# EAGLE design L_SaturationMeter (EAGLE 6.1)
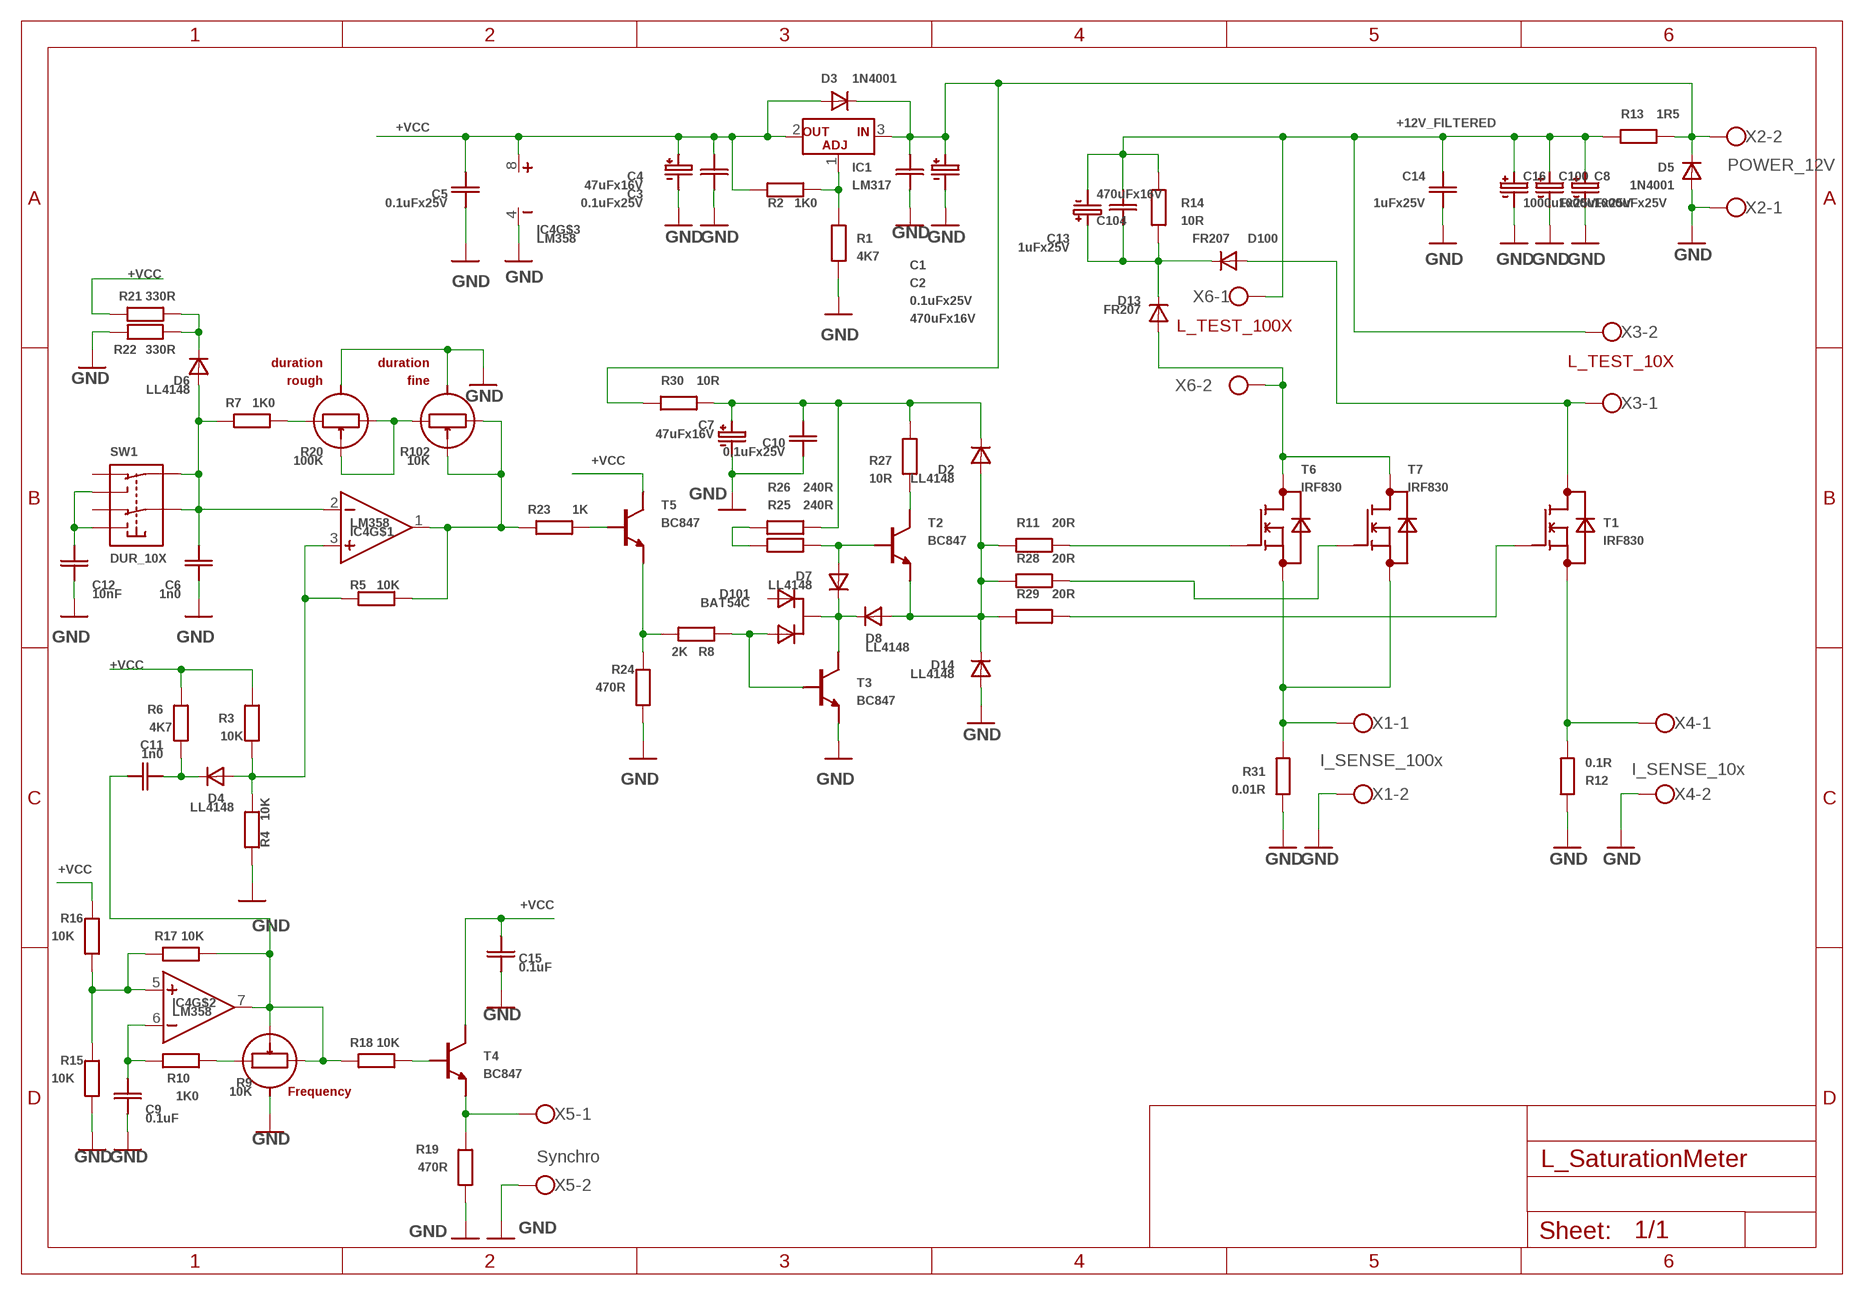
[diagram p0: schematic, sheet 1]

## Parts
C1  0.1uFx25V  CSMD_1206_BIG_GAP  [RSMD_1206_BIG_GAP]
C2  470uFx16V  CE8.2MM  [CE_8.2MM]
C3  0.1uFx25V  CSMD_0805  [RSMD_0805]
C4  47uFx16V  CE5.2MM  [CE_5.2MM]
C5  0.1uFx25V  CSMD_0805  [RSMD_0805]
C6  1n0  CSMD_0805  [RSMD_0805]
C7  47uFx16V  CE5.2MM  [CE_5.2MM]
C8  1000uFx25V  CE10MM  [CE_10MM]
C9  0.1uF  CSMD_0805  [RSMD_0805]
C10  0.1uFx25V  CSMD_0805  [RSMD_0805]
C11  1n0  CSMD_0805  [RSMD_0805]
C12  10nF  CSMD_0805  [RSMD_0805]
C13  1uFx25V  CSMD_1206_BIG_GAP  [RSMD_1206_BIG_GAP]
C14  1uFx25V  CSMD_1206_BIG_GAP  [RSMD_1206_BIG_GAP]
C15  0.1uF  CSMD_0805  [RSMD_0805]
C16  1000uFx25V  CE10MM  [CE_10MM]
C100  1000uFx25V  CE10MM  [CE_10MM]
C104  470uFx16V  CE8.2MM  [CE_8.2MM]
D2  LL4148  LL4147SOD-80  [SOD-80]
D3  1N4001  1N4001DO-41_15MM  [DO-41_15MM]
D4  LL4148  LL4147SOD-80  [SOD-80]
D5  1N4001  1N4001DO-41_15MM  [DO-41_15MM]
D6  LL4148  LL4147SOD-80  [SOD-80]
D7  LL4148  LL4147SOD-80  [SOD-80]
D8  LL4148  LL4147SOD-80  [SOD-80]
D13  FR207  1N4001DO-41_5MM  [DO-41_5MM]
D14  LL4148  LL4147SOD-80  [SOD-80]
D100  FR207  1N4001DO-41_20MM  [DO-41_20MM]
D101  BAT54C  BAT54C(SOT23)  [SOT23_SMALL_PADS]
IC1  LM317  LM317(D2PAK)  [D2PAK]
IC4  LM358  LM358DIP8  [DIP8]
R1  4K7  RSMD_0805  [RSMD_0805]
R2  1K0  RSMD_0805  [RSMD_0805]
R3  10K  RSMD_0805  [RSMD_0805]
R4  10K  RSMD_0805  [RSMD_0805]
R5  10K  RSMD_0805  [RSMD_0805]
R6  4K7  RSMD_0805  [RSMD_0805]
R7  1K0  RSMD_0805  [RSMD_0805]
R8  2K  RSMD_0805  [RSMD_0805]
R9  10K  R_ADJ_WITH_SHIELDSP4-AM  [SP3-4AM]
R10  1K0  RSMD_0805  [RSMD_0805]
R11  20R  RSMD_0805  [RSMD_0805]
R12  0.1R  R1.0W_VERT  [R_1.0W_VERTICAL]
R13  1R5  R2.0W  [R_2.0W]
R14  10R  R1.0W_VERT  [R_1.0W_VERTICAL]
R15  10K  RSMD_0805  [RSMD_0805]
R16  10K  RSMD_0805  [RSMD_0805]
R17  10K  RSMD_0805  [RSMD_0805]
R18  10K  RSMD_0805  [RSMD_0805]
R19  470R  RSMD_1206_BIG_GAP  [RSMD_1206_BIG_GAP]
R20  100K  R_ADJ_WITH_SHIELDSP4-AM  [SP3-4AM]
R21  330R  RSMD_0805  [RSMD_0805]
R22  330R  RSMD_0805  [RSMD_0805]
R23  1K  RSMD_1206_BIG_GAP  [RSMD_1206_BIG_GAP]
R24  470R  RSMD_1206_BIG_GAP  [RSMD_1206_BIG_GAP]
R25  240R  RSMD_1206_BIG_GAP  [RSMD_1206_BIG_GAP]
R26  240R  RSMD_1206_BIG_GAP  [RSMD_1206_BIG_GAP]
R27  10R  RSMD_1206_BIG_GAP  [RSMD_1206_BIG_GAP]
R28  20R  RSMD_0805  [RSMD_0805]
R29  20R  RSMD_0805  [RSMD_0805]
R30  10R  R0.5W  [R_0.5W]
R31  0.01R  RSMD_2512  [RSMD_2512]
R102  10K  R_ADJ_WITH_SHIELDSP4-AM  [SP3-4AM]
SW1  DUR_10X  SWITCH_DOUBLE(2.54X4MM)  [SWITCH_DOUBLE_2.54X4.0MM]
T1  IRF830  IRF830D2PAK  [D2PAK]
T2  BC847  BC847SOT23_SMALL_PADS  [SOT23_SMALL_PADS]
T3  BC847  BC847SOT23_SMALL_PADS  [SOT23_SMALL_PADS]
T4  BC847  BC847SOT23_SMALL_PADS  [SOT23_SMALL_PADS]
T5  BC847  BC847SOT23_SMALL_PADS  [SOT23_SMALL_PADS]
T6  IRF830  IRF830D2PAK  [D2PAK]
T7  IRF830  IRF830D2PAK  [D2PAK]
X1  I_SENSE_100x  W237-102  [W237-102]
X2  POWER_12V  W237-102  [W237-102]
X3  L_TEST_END  W237-102  [W237-102]
X4  I_SENSE_10x  W237-102  [W237-102]
X5  Synchro  W237-102  [W237-102]
X6  L_TEST_END  W237-102  [W237-102]

## Nets
+12V_FILTERED: C8.PLUS C13.PAD_0(PIN0) C14.PAD_0(PIN0) C16.PLUS C100.PLUS C104.MINUS R13.PAD1(PIN1) R14.PAD1(PIN1) X3.2 X6.1
+VCC: C3.PAD_0(PIN0) C4.PLUS C5.PAD_0(PIN0) C15.PAD_0(PIN0) D3.ANODE IC1.2(OUT) IC4.8(VCC) R2.PAD_1(PIN1) R3.PAD_1(PIN1) R6.PAD_0(PIN0) R16.PAD_1(PIN1) R21.PAD_1(PIN1) T4.3(C) T5.3(C)
GND: C1.PAD_1(PIN1) C2.MINUS C3.PAD_1(PIN1) C4.MINUS C5.PAD_1(PIN1) C6.PAD_1(PIN1) C7.MINUS C8.MINUS C9.PAD_1(PIN1) C10.PAD_1(PIN1) C12.PAD_1(PIN1) C14.PAD_1(PIN1) C15.PAD_1(PIN1) C16.MINUS C100.MINUS D5.ANODE D14.ANODE IC4.4(GND) R1.PAD_0(PIN0) R4.PAD_1(PIN1) R9.PACKAGE1(PACKAGE) R9.PACKAGE2(PACKAGE) R12.PAD1(PIN1) R15.PAD_0(PIN0) R19.PAD_1(PIN1) R20.PACKAGE1(PACKAGE) R20.PACKAGE2(PACKAGE) R22.PAD_0(PIN0) R24.PAD_1(PIN1) R31.PAD0(PIN0) R102.PACKAGE1(PACKAGE) R102.PACKAGE2(PACKAGE) T3.2(E) X1.2 X2.1 X4.2 X5.2
N$1: D7.ANODE R25.PAD_1(PIN1) T2.1(B)
N$2: R11.PAD_1(PIN1) T6.1(GATE)
N$3: R12.PAD_0(PIN0) T1.3(SOURCE) X4.1
N$4: C9.PAD_0(PIN0) IC4.6(IN-) R10.PAD_0(PIN0)
N$5: R9.END_A R10.PAD_1(PIN1)
N$6: C13.PAD_1(PIN1) C104.PLUS D13.CATHODE D100.CATHODE R14.PAD_0(PIN0)
N$7: C6.PAD_0(PIN0) D6.ANODE IC4.2(IN-) R7.PAD_1(PIN1) SW1.CENTER1 SW1.CENTER2
N$8: IC1.1(ADJ) R1.PAD_1(PIN1) R2.PAD_0(PIN0)
N$10: D100.ANODE T1.2(DRAIN) X3.1
N$11: C1.PAD_0(PIN0) C2.PLUS D3.CATHODE D5.CATHODE IC1.3(IN) R13.PAD_0(PIN0) R30.PAD1(PIN1) X2.2
N$12: IC4.5(IN+) R15.PAD_1(PIN1) R16.PAD_0(PIN0) R17.PAD_1(PIN1)
N$13: C11.PAD_1(PIN1) IC4.7(OUT) R9.END_B R9.MIDDLE R17.PAD_0(PIN0) R18.PAD_1(PIN1)
N$14: D4.ANODE IC4.3(IN+) R3.PAD_0(PIN0) R4.PAD_0(PIN0) R5.PAD_1(PIN1)
N$15: R20.END_B R20.MIDDLE R102.END_A
N$16: R25.PAD_0(PIN0) R26.PAD_1(PIN1)
N$18: C11.PAD_0(PIN0) D4.CATHODE R6.PAD_1(PIN1)
N$19: R18.PAD_0(PIN0) T4.1(B)
N$20: R19.PAD_0(PIN0) T4.2(E) X5.1
N$21: D6.CATHODE R21.PAD_0(PIN0) R22.PAD_1(PIN1)
N$22: C12.PAD_0(PIN0) SW1.POS_A1 SW1.POS_A2
N$23: IC4.1(OUT) R5.PAD_0(PIN0) R23.PAD_1(PIN1) R102.END_B R102.MIDDLE
N$24: R23.PAD_0(PIN0) T5.1(B)
N$25: R8.PAD_0(PIN0) R24.PAD_0(PIN0) T5.2(E)
N$26: D101.2(ANODE2) R8.PAD_1(PIN1) T3.1(B)
N$27: D7.CATHODE D8.CATHODE D101.3(CATHODE) T3.3(C)
N$28: R28.PAD_1(PIN1) T7.1(GATE)
N$29: R27.PAD_1(PIN1) T2.3(C)
N$30: D2.ANODE D8.ANODE D14.CATHODE R11.PAD_0(PIN0) R28.PAD_0(PIN0) R29.PAD_0(PIN0) T2.2(E)
N$31: R29.PAD_1(PIN1) T1.1(GATE)
N$32: R31.PAD1(PIN1) T6.3(SOURCE) T7.3(SOURCE) X1.1
N$33: C7.PLUS C10.PAD_0(PIN0) D2.CATHODE R26.PAD_0(PIN0) R27.PAD_0(PIN0) R30.PAD_0(PIN0)
N$34: D13.ANODE T6.2(DRAIN) T7.2(DRAIN) X6.2
N$35: R7.PAD_0(PIN0) R20.END_A
Unconnected: D101.1(ANODE1) SW1.POS_B1 SW1.POS_B2

## Notes on the sheet
- L_TEST_100X
- duration | duration | L_TEST_10X
- rough | fine
- Frequency

## Library data of the parts
C1 C3 C5 C6 C9-C15 = __MyCommonLib1:C
C2 C4 C7 C8 C16 C100 C104 = __MyCommonLib1:CE
D2 D4 D6-D8 D14 = __MyCommonLib1:LL4147
D3 D5 D13 D100 = __MyCommonLib1:1N4001
D101 = __MyCommonLib1:BAT54C
IC1 = __MyCommonLib1:LM317
IC4 = __MyCommonLib1:LM358
R1-R8 R10-R19 R21-R31 = __MyCommonLib1:R
R9 R20 R102 = __MyCommonLib1:R_ADJ_WITH_SHIELD
SW1 = __MyCommonLib1:SWITCH_DOUBLE
T1 T6 T7 = __MyCommonLib1:IRF830
T2-T5 = __MyCommonLib1:BC847
X1-X6 = con-wago-500:W237-102: WAGO SCREW CLAMP; MPN: 237-102; OC_FARNELL: unknown; OC_NEWARK: 70K9898

## Board
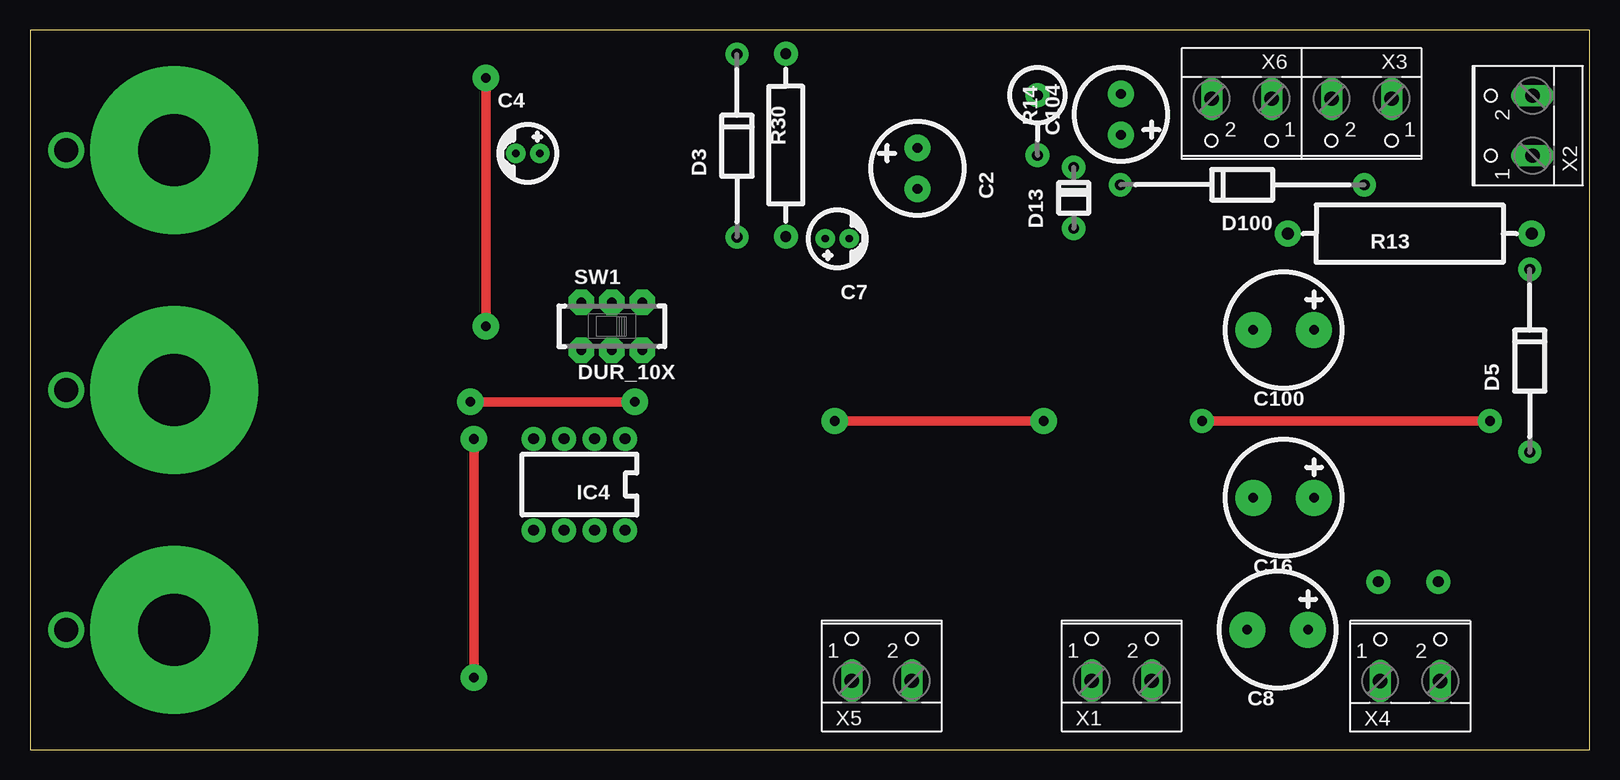
[diagram p1: board, top side]
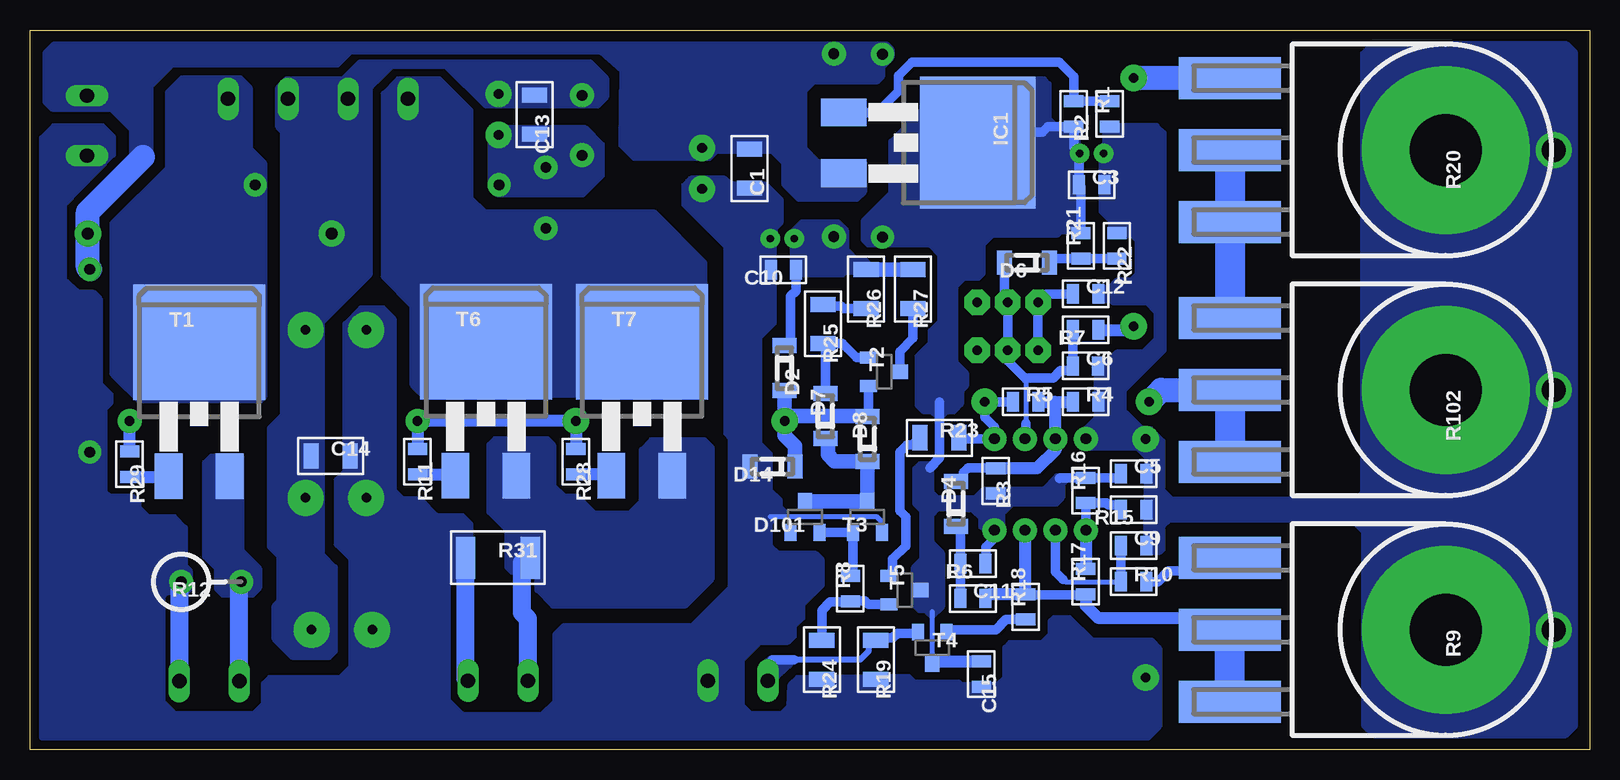
[diagram p2: board, bottom side, seen from below]

Size 130 x 60 mm. Coordinates in mm from the lower left corner, seen from the top.
Outline: 0,0 130,0 130,60 0,60 0,0
Copper layers (1*16): Top 0.035mm / dielectric 1.5mm / Bottom 0.035mm
Design rules: minimum track width 0.4mm, minimum drill 0.6mm, track to track 0.35mm, track to pad 0.35mm, pad to pad 0.35mm, via to via 0.35mm, smd to smd 0.35mm, copper to edge 0.5mm, drill to drill 8mil, minimum pad ring 10mil, minimum via ring 8mil, stop-mask expansion 4mil, vias tented up to drill 0mil, thermal gap 10mil

### Footprints (pad centres in the part's own frame; a part is rotated, then mirrored left to right if it is on the bottom)
RSMD_1206_BIG_GAP = smd 1.25 x 2.1: PAD_0 -1.625,0; PAD_1 1.625,0
CE_8.2MM = drill 0.8 pad 2.2: MINUS -1.7,0; PLUS 1.7,0
RSMD_0805 = smd 1 x 1.6: PAD_0 -1.05,0; PAD_1 1.05,0
CE_5.2MM = drill 0.6 pad 1.6: MINUS -1,0; PLUS 1,0
CE_10MM = drill 0.8 pad 3: MINUS -2.54,0; PLUS 2.54,0
SOD-80 = smd 1.25 x 2: ANODE 1.875,0; CATHODE -1.875,0
DO-41_15MM = drill 0.9 pad 1.93: ANODE -7.62,0; CATHODE 7.62,0
DO-41_5MM = drill 0.9 pad 1.93: ANODE -2.54,0; CATHODE 2.54,0
DO-41_20MM = drill 0.9 pad 1.93: ANODE -10.16,0; CATHODE 10.16,0
SOT23_SMALL_PADS = smd 1 x 1.4: 1 1.2,1.3; 2 -1.2,1.3 | smd 1.2 x 1.4: 3 0,-1.3
D2PAK = smd 2.32 x 3.81: 1 -2.54,-11.17; 3 2.54,-11.17 | smd 11 x 9.65: 2 0,0
DIP8 = drill 0.9 pad 2: 1 -3.81,-3.81; 2 -1.27,-3.81; 3 1.27,-3.81; 4 3.81,-3.81; 5 3.81,3.81; 6 1.27,3.81; 7 -1.27,3.81; 8 -3.81,3.81
SP3-4AM = smd 3.5 x 8.5: END_A -6,-18; END_B 6,-18; MIDDLE 0,-18 | drill 6 pad 14: PACKAGE1 0,0 | drill 2 pad 3: PACKAGE2 0,9
R_1.0W_VERTICAL = drill 0.9 pad 2: PAD1 2.5,0; PAD_0 -2.5,0
R_2.0W = drill 1 pad 2.2: PAD1 10.16,0; PAD_0 -10.16,0
R_0.5W = drill 0.9 pad 2: PAD1 7.62,0; PAD_0 -7.62,0
RSMD_2512 = smd 1.6 x 3.5: PAD0 -2.7,0; PAD1 2.7,0
SWITCH_DOUBLE_2.54X4.0MM = drill 0.8 pad 2.1 octagon: CENTER1 0,-2; CENTER2 0,2; POS_A1 -2.54,-2; POS_A2 -2.54,2; POS_B1 2.54,-2; POS_B2 2.54,2
W237-102 = drill 1.194 long: 1 -2.5,-1.27; 2 2.5,-1.27

### Placement (x,y rotation side)
C1  70.03,48.45 270 bottom
C2  73.98,48.45 90 top
C3  41.5,47.1 0 bottom
C4  41.5,49.7 0 top
C5  38,23 0 bottom
C6  42.01,31.99 0 bottom
C7  67.3,42.6 180 top
C8  104,10 0 top
C9  38,17 0 bottom
C10  67.2,40 180 bottom
C11  51.4,12.6 0 bottom
C12  42,38 0 bottom
C13  87.95,52.95 270 bottom
C14  104.94,24.47 0 bottom
C15  50.7,6.3 270 bottom
C16  104.5,21 0 top
C100  104.5,34.99 0 top
C104  90.94,52.95 270 top
D2  67.11,31.8 270 bottom
D3  58.93,50.35 90 top
D4  52.8,20.5 90 bottom
D5  125.02,32.42 90 top
D6  46.9,40.6 180 bottom
D7  63.7,27.8 90 bottom
D8  60.2,25.9 90 bottom
D13  87,46 90 top
D14  68.1,23.6 180 bottom
D100  101.06,47.09 180 top
D101  65.4,19.4 180 bottom
IC1  51,50.59 270 bottom
IC4  45.8,22.1 180 top
R1  40,53 90 bottom
R2  43,53 270 bottom
R3  49.5,22.4 270 bottom
R4  42,29 0 bottom
R5  47,29 0 bottom
R6  51.4,15.5 180 bottom
R7  42,35 180 bottom
R8  61.61,13.41 90 bottom
R9  12,10 270 bottom
R10  38,14 0 bottom
R11  97.7,24 270 bottom
R12  114.9,14 180 bottom
R13  115.01,43.02 180 top
R14  83.99,52.05 90 top
R15  38,20 180 bottom
R16  42,21.6 90 bottom
R17  42,14 90 bottom
R18  47,11.9 90 bottom
R19  59.5,7.5 270 bottom
R20  12,50 270 bottom
R21  42.4,42 90 bottom
R22  39.4,42 270 bottom
R23  54.2,26 0 bottom
R24  64,7.5 270 bottom
R25  63.9,35.5 270 bottom
R26  60.3,38.4 270 bottom
R27  56.4,38.4 270 bottom
R28  84.5,24 270 bottom
R29  121.7,23.8 270 bottom
R30  63,50.4 90 top
R31  91,16 0 bottom
R102  12,30 270 bottom
SW1  48.5,35.3 0 top
T1  115.89,33.96 0 bottom
T2  58.8,31.5 90 bottom
T3  60.2,19.4 180 bottom
T4  54.8,8.5 0 bottom
T5  57.1,13.3 90 bottom
T6  92,34 0 bottom
T7  79,34 0 bottom
X1  91,7 0 top
X2  123.98,52.02 90 top
X3  111,53 180 top
X4  115.05,6.98 0 top
X5  71,7 0 top
X6  101,53 180 top

### Tracks (layer width: path | path; a pad name or v marks a point on that pad's centre or on a via)
+12V_FILTERED
  pour Bottom (no thermals): 108.6,55.9 102.5,55.9 101.7,55.1 101.7,39.6 105.7,35.6 105.7,16.3 104.6,15.2 104.6,8.2 105.1,7.7 108.1,7.7 109.6,9.2 109.6,12 109.2,12.4 109.2,16.1 110,16.9 110,26.8 108.9,27.9 108.9,51.5 109.3,51.9 109.3,55.2
  pour Bottom (no thermals): 82.7,53.7 92,53.7 95.3,57 99.9,57 101.9,55 101.9,53 104.8,53 104.8,55 102.5,57.3 83.3,57.3 82,56 82,54.4
+VCC
  Bottom 0.4: 54.8,11.5 T4.3
  Bottom 0.8: IC4.8 49.61,17.59 50.3,16.9 50.3,15.55 R6.PAD_0 | R21.PAD_1 42.4,46.95 C3.PAD_0 42.55,49.65 C4.PLUS 43,50.2 R2.PAD_1 45.15,51.95 45.6,51.5 50.09,51.5 IC1.2 | 55,23.5 54.2,24.3 54.2,29 | C5.PAD_0 39.05,22.65 R16.PAD_1 44.15,22.65 44.2,22.6
  Bottom 1: T4.3 54.65,7.35 C15.PAD_0
  pour Bottom (no thermals): 55.5,55.9 45.5,55.9 45.1,55.5 45.1,52.6 44.5,52 42.9,52 42.7,51.8 42.7,50 42.4,49.7 42.4,43.2 44.1,43.2 44.4,42.9 49.8,42.9 50.6,42.1 50.6,39.7 51,39.3 52.2,39.3 52.9,38.6 52.9,32.3 52,31.4 52,30.3 52.4,29.9 52.4,28.8 53,28.2 53.6,28.2 54,27.8 54.4,27.8 54.8,28.2 55.5,28.2 56,28.7 56,32.8 54.9,33.9 54.9,34.9 54.1,35.7 54.1,41.2 55,42.1 60.1,42.1 60.5,42.5 60.5,44.1 58.2,46.4 58.2,50.7 55.6,53.4
  pour Bottom (no thermals): 44,22.1 44,21 44.5,20.5 48.2,20.5 49,19.7 49,18.2 50.3,18.2 50.7,18.6 50.7,19.3 51.4,20 54.3,20.1 54.9,19.5 54.9,17.3 54,16.4 54,11.9 54.8,11.1 55.3,11.6 55.8,11.6 56.3,12.1 56.3,15.2 55.6,15.9 55.6,19.9 56.2,20.5 56.2,23.4 55.8,23.8 54.9,23.8 54.9,21.5 54.4,21 51.2,21 50.5,21.7 45.5,21.7 44.4,22.8 43.9,22.8 43.6,22.5
GND  (via drill 0.8 pad 2.2)
  Top 0.8: v37,25.9 v37,6
  Bottom 0.4: T3.2 59,19 59.4,19.4 68.3,19.4
  Bottom 0.8: C5.PAD_1 37,23
  Bottom 1.5: X1.2 93.7,5.93 R31.PAD0 | R12.PAD1 117.55,13.85 X4.2
  pour Bottom (no thermals): 100.6,36.8 99.7,35.9 99.7,21.6 99,20.9 97.5,20.9 96.1,19.5 94,19.5 93.3,18.8 93.3,14.2 93.2,14.1 94.9,14.1 95.2,13.8 95.2,4.1 94,2.9 87.3,2.9 86.2,4 86.2,9.6 85.5,10.3 70.7,10.3 70.7,3.7 70,3 67.3,3 66.7,3.6 66.6,5.4 66,6 56.8,6.1 56.3,5.6 52.6,5.6 52.4,5.4 49.3,5.4 48.7,6 48.7,8.5 48.3,8.9 45.6,8.9 44.9,9.6 44.9,10.7 44.6,11 43.4,11 41.5,9.1 36.5,9.1 35.9,8.5 35.9,1.9 36.8,1 129,1 129,51 128,52 124,52 123.1,51.1 123.1,49.6 127.2,45.4 127.2,39.2 126,38.1 124.7,38.1 124.2,37.6 124.2,30.5 123.3,29.6 123.3,28.9 123.8,28.4 123.8,21.5 123.4,21.1 121.5,21.1 121,20.6 121,20.2 120.2,19.4 118,19.4 117.1,18.5 117.1,15.3 116.7,14.9 116.7,13.4 117,13.1 118.6,13.1 119,12.7 119,4 118,3 111.3,3 110.5,3.8 110.5,5.5 110,6 104.1,6 103.2,6.9 103.2,15.9 104.4,17.1 104.4,22.5 103.7,23.2 103.7,35.5 102.4,36.8
  pour Bottom (no thermals): 67.4,45.8 68.7,47.1 71.6,47.1 72.1,47.6 74.9,47.6 75.5,47 75.5,45.5 72,42 72,26.4 71.6,26 71.6,13.5 75,10.1 75,5 70.7,5 70.7,7.5 69.2,9 66.8,9 66.3,9.5 66.3,10.3 65.6,11 65.6,12.1 64,13.7 64,15.8 64.5,16.3 67.6,16.3 68.3,17 68.3,18.9 67.6,19.6 66.9,19.6 67.5,20.2 67.5,20.8 68.3,21.6 68.3,24.6 69.2,25.5 69.2,34.4 68,35.6 68,42.2 67.9,42.3 67.9,43.5 67.4,44
  pour Bottom (no thermals): 1.9,58.8 18.1,58.8 18.9,58 18.9,21.4 19.5,20.8 34.8,20.8 35.6,21.6 35.6,25.7 36.6,26.7 37.5,26.7 37.6,26.6 37.6,25.1 36.9,24.4 37,19.2 37,16.7 36.8,16.5 35.8,16.5 35.6,16.7 35.6,18.6 35,19.2 19.8,19.2 18.8,18.2 18.8,2 18,1.2 2,1.2 1.2,2 1.2,58.1
  pour Bottom (no thermals): 39.9,52 40.4,51.5 40.4,51.1 40.4,50.5 40.7,50.2 40.7,44.9 39.9,44.1 39.9,43 39.8,42.9 38.1,42.9 37.8,42.6 37.7,42.5 37.7,41.1 37.7,39.6 38.2,39.1 39.4,39.1 40,38.5 41.1,38.5 41.1,37.5 39.9,37.5 39.7,37.3 36.9,37.3 36.1,36.5 36.1,34.2 37.2,33.1 39.4,33.1 40,32.5 41.1,32.5 41.1,27.6 41.6,27.1 42.1,26.6 42.1,25.6 42.1,25.2 36.5,25.2 36.5,26.6 37.2,26.6 38.5,27.9 38.8,28.2 38.8,29.6 38.8,30 37.4,31.4 35.5,33.3 35.5,35.3 35.5,51.4 36.1,52
N$1
  Bottom 0.8: D7.ANODE 63.7,33.67 R25.PAD_1 62.27,33.88 61.1,32.7 T2.1
N$2
  Bottom 1: R11.PAD_1 94.54,22.95 T6.1
N$3
  Bottom 1.5: X4.1 112.55,13.85 R12.PAD_0
  pour Bottom (no thermals): 112.4,24.4 112.4,16.6 110.9,15.1 110.9,13.5 111.5,12.9 113.9,12.9 114.4,13.4 114.4,15.1 115.4,16.1 115.4,23.9 114.8,24.5
N$4
  Bottom 0.4: 43.9,14.2 43.7,14 R10.PAD_0
  Bottom 0.8: R10.PAD_0 C9.PAD_0 | IC4.6 44.53,14.83 43.9,14.2
N$5
  Bottom 0.8: R9.END_A 31.1,14.9 35.1,14.9 36,14 R10.PAD_1
N$6
  pour Bottom (no thermals): 91.6,51.8 91.6,46.9 91,46.3 83.9,46.3 82.3,47.9 82.3,50.4 83.7,51.8
N$7
  Bottom 0.4: 47,30.9 47,27.18
  Bottom 0.8: R7.PAD_1 C6.PAD_0 | C6.PAD_0 43.06,32.4 | C6.PAD_0 43.45,31.6 44.1,31.6 44.7,31 46.9,31 47,30.9 48.5,32.4 SW1.CENTER1 SW1.CENTER2 48.77,37.58 D6.ANODE | 47,27.18 47,25.91 IC4.2
N$8
  Bottom 0.8: R1.PAD_1 R2.PAD_0 43,56.1 44.2,57.3 56.5,57.3 57.6,56.2 57.6,54.9 59.4,53.1 62.14,53.1 IC1.1
N$10
  pour Bottom (no thermals): 111.7,55.2 111.7,50.1 110.5,48.9 110.5,29.4 110.8,29.1 120.9,29.1 122.8,31 123.1,31.3 123.1,42.9 123.1,43.9 118.5,48.5 118.5,54.8 117.3,56 112.5,56
N$11
  Bottom 2: D5.CATHODE 125.17,40.19 R13.PAD_0 125.17,44.83 120.6,49.4
  pour Bottom (no thermals): 60.5,49 60.5,46.5 61.1,45.9 65.9,45.9 67.1,47.1 67.1,48.9 68.1,49.9 72.8,49.9 73.4,49.3 79.6,49.3 80.7,50.4 80.6,56.6 82.4,58.2 103.3,58.2 104.4,57.1 118.2,57.1 120,55.3 120,49.2 121.5,49.2 121.5,51.7 123.2,53.4 128.1,53.4 128.7,54 128.7,58.1 128,58.8 58.6,58.8 58.2,58.4 58.2,57.7 59,56.9 59,56.1 59.4,55.7 64.7,55.7 65.5,54.9 65.5,50.2 64.3,49
N$12
  Bottom 0.8: R15.PAD_1 39.45,20.4 40.1,20.4 40.25,20.55 R16.PAD_0 IC4.5
  Bottom 1: IC4.5 R17.PAD_1
N$13
  Bottom 0.8: R17.PAD_0 42.05,12.9 46.9,12.9 46.95,12.95 R18.PAD_1
  Bottom 1: R17.PAD_0 42,12 41,11 31,11 R9.MIDDLE | C11.PAD_1 50,12.95 R18.PAD_1 47.07,13.02 IC4.7
  Bottom 2.5: R9.END_B R9.MIDDLE
N$14
  Bottom 0.8: R3.PAD_0 49.55,23.5 51.8,23.5 52.2,23.1 52.2,22.4 52.23,22.38 D4.ANODE
  Bottom 1: R5.PAD_1 44.6,29 | 44.6,29 R4.PAD_0 | 44.6,29 44.53,28.93 IC4.3 44.5,25.88 44.5,25 46.05,23.45 R3.PAD_0
N$15
  Bottom 2.5: R20.MIDDLE R20.END_B R102.END_A
N$16
  Bottom 0.8: R26.PAD_1 62.17,36.77 62.4,37 63.77,37 R25.PAD_0
N$18
  Bottom 0.8: D4.CATHODE 52.45,18.27 R6.PAD_1 C11.PAD_0
N$19
  Bottom 0.8: R18.PAD_0 48.65,10.85 49.5,10 53.4,10 T4.1
N$20
  Bottom 0.5: R19.PAD_0 60.1,9.12 60.1,8.2 60.8,7.5 66.3,7.5
  Bottom 0.8: T4.2 56.1,9.7 57.7,9.7 58.1,9.3 59.33,9.3 R19.PAD_0 | 66.3,7.5 68.1,7.5 68.5,7.1
  pour Bottom (no thermals): 68.2,7.5 68.6,7.1 68.6,5.6 68.4,5.6 67.4,6.6 66.5,7.5
N$21
  Bottom 0.8: R22.PAD_1 R21.PAD_0 44.67,40.95 D6.CATHODE
N$22
  Bottom 0.8: SW1.POS_A1 SW1.POS_A2 45.26,38 C12.PAD_0
N$23  (via drill 0.8 pad 2.2)
  Top 0.8: v36.7,29 v50.4,29
  Bottom 0.8: R23.PAD_1 52.58,25.91 IC4.1 49.61,26.91 50.4,27.7 v50.4,29 R5.PAD_0
  Bottom 2: v36.7,29 35.7,30 R102.MIDDLE
  Bottom 2.5: R102.MIDDLE R102.END_B
N$24
  Bottom 0.8: R23.PAD_0 56.42,25.4 56.9,25.4 57.5,24.8 57.5,19.9 57,19.4 57,17 58.1,15.9 58.1,14.8 T5.1
N$25
  Bottom 0.8: T5.2 60.1,12.1 60.4,12.4 61.57,12.4 R8.PAD_0 61.67,12.3 63.3,12.3 64,11.6 R24.PAD_0
N$26
  Bottom 0.8: R8.PAD_1 61.4,14.67 T3.1 D101.2
N$27
  Bottom 1.2: D101.3 T3.3 D8.CATHODE 62.92,24.02 63.5,24.6 63.5,25.73 D7.CATHODE
N$28
  Bottom 1: T7.1 81.66,22.95 R28.PAD_1
N$29
  Bottom 0.8: R27.PAD_1 56.4,34.3 57.5,33.2 T2.3
N$30  (via drill 0.8 pad 2, 0.8 pad 2.2)
  Top 0.8: v121.7,27.4 v97.7,27.4 | v84.5,27.4 v67.1,27.4
  Bottom 0.8: R29.PAD_0 121.67,24.88 | 121.67,27.38 v121.7,27.4 | T2.2 60.1,27.88 D8.ANODE
  Bottom 1: 121.67,24.88 121.67,27.38 | R28.PAD_0 v84.5,27.4 v97.7,27.4 R11.PAD_0
  Bottom 1.2: D8.ANODE 60.23,27.8 66.7,27.8 v67.1,27.4 | D2.ANODE v67.11,27.41 v67.1,27.4 | D14.CATHODE 66.22,25.32 67.1,26.2 v67.1,27.4
N$31
  Bottom 0.8: 118.47,22.75 T1.1
  Bottom 1: R29.PAD_1 118.47,22.75
N$32
  Bottom 1.5: X1.1 88.5,10.9 89,11.4 89,15.6 88.6,16 R31.PAD1
  pour Bottom (no thermals): 73.2,25.2 73.2,14.2 75.4,12 86.4,12 87.7,13.3 87.7,14.4 88.1,14.8 89.8,14.8 90.2,15.2 90.2,18.3 91.7,19.8 91.7,25.4 91.2,25.9 86.9,25.9 86.4,25.4 86.4,22 85.5,21.1 84.4,21.1 83,19.7 80,19.7 79,20.7 79,25 78.2,25.8 73.8,25.8
N$33
  Bottom 0.8: C10.PAD_0 66.15,38.25 66.6,37.8 66.6,34.19 D2.CATHODE
  Bottom 1.2: R27.PAD_0 R26.PAD_0
  pour Bottom (no thermals): 60.1,39.8 62.1,39.8 62.3,39.6 66.4,39.6 66.4,42 66.7,42.3 66.7,42.9 65.6,44 62.7,44 62,43.3 62,41.7 61.1,40.8 60.4,40.8 60.1,40.5
N$34
  pour Bottom (no thermals): 75.2,29.5 97.3,29.6 98.1,30.4 98.1,37 100.5,39.4 100.5,54.7 99.3,55.9 95.9,55.9 93.3,53.3 93.3,46 92.1,44.8 78,44.8 73.8,40.6 73.8,30 74.3,29.5
N$35  (via drill 0.8 pad 2.2)
  Top 0.8: v38,35.3 v38,56
  Bottom 1: R7.PAD_0 38.3,35 v38,35.3
  Bottom 1.5: R20.END_A 30.1,56.1 30.1,56
  Bottom 2: 30.1,56 v38,56